# Altium schematic sheet KF7.62-2P_C51736651_KF7.62-2P_C5173665.schdoc
size 124 x 99 mm
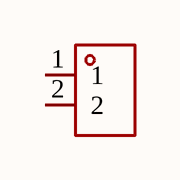
[diagram p0: KF7.62-2P_C51736651_KF7.62-2P_C5173665.schdoc]

## Parts
U?  KF7.62-2P(green)  [CONN-TH_2P-P7.62_KEFA_KF7.62-2P]  (value not drawn)

## Nets

Not connected (* = marked no-connect by the designer): U? 1 2

## Library data of the parts
U? = KF7.62-2P(green): Manufacturer: KEFA(科发); Symbol: KF7.62-2P_C5173665; Add into BOM: yes; Pitch: 7.62mm; Pin Location: Side Mount; Number of PINs Per Row: 2; Screw Specification: M3; Current Rating: 24A; Voltage Rating (Max): 450V; Wire Gauge - AWG: 12~22; Wire Gauge - mm2: 2.5; Device: KF7.62-2P(green); LCSC Part Name: 绿色尼龙环保 7.62mm 边脚 1; Supplier Part: C5173665; Manufacturer Part: KF7.62-2P(green); Supplier Footprint: 插件,P=7.62mm; JLCPCB Part Class: Extended Part; Datasheet: https://item.szlcsc.com/datasheet/KF7.62-2P(green)/5823755.html; Supplier: LCSC; Convert to PCB: yes; Number of Pins: 2P; Number of Rows: 1; Operating Temperature: -40℃~+105℃